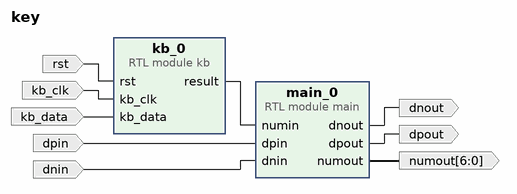
[diagram p0: block diagram of the top level]
# Vivado block design key, xc7a35tcsg324-3, Vivado 2017.1
create_bd_design key

create_bd_port -dir O dpout
create_bd_port -dir O dnout
create_bd_port -dir O -from 6 -to 0 numout
create_bd_port -dir I dpin
create_bd_port -dir I dnin
create_bd_port -dir I -type rst rst
create_bd_port -dir I -type clk kb_clk
set_property -dict {CONFIG.FREQ_HZ 100000000} [get_bd_ports kb_clk]
create_bd_port -dir I kb_data

create_bd_cell -type module -reference main main_0
create_bd_cell -type module -reference kb kb_0

# ---- connections ----

connect_bd_net -net kb_0_PA [get_bd_pins kb_0/result] [get_bd_pins main_0/numin]
connect_bd_net [get_bd_pins main_0/dpout] [get_bd_ports dpout]
connect_bd_net [get_bd_pins main_0/dnout] [get_bd_ports dnout]
connect_bd_net [get_bd_pins main_0/numout] [get_bd_ports numout]
connect_bd_net [get_bd_ports dpin] [get_bd_pins main_0/dpin]
connect_bd_net [get_bd_ports dnin] [get_bd_pins main_0/dnin]
connect_bd_net [get_bd_ports rst] [get_bd_pins kb_0/rst]
connect_bd_net [get_bd_ports kb_clk] [get_bd_pins kb_0/kb_clk]
connect_bd_net [get_bd_ports kb_data] [get_bd_pins kb_0/kb_data]

validate_bd_design
save_bd_design
